# Altium schematic sheet main.SchDoc
size A4; SheetNumber: 1; SheetTotal: 6
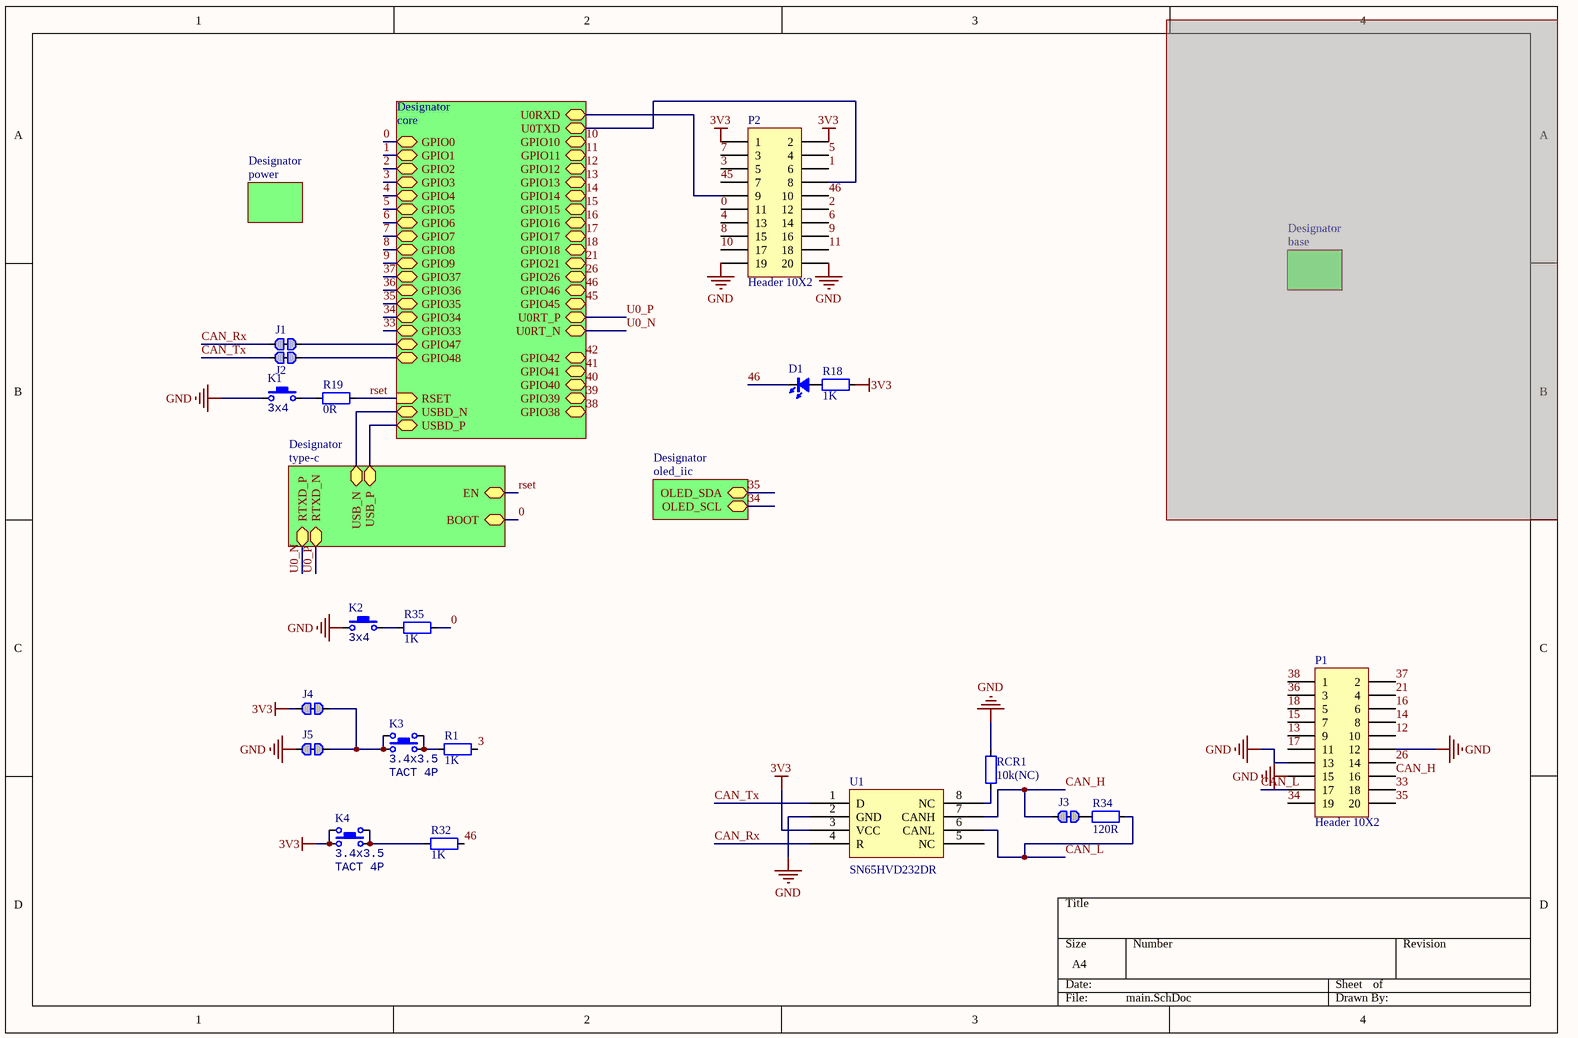
[diagram p0: main.SchDoc]

## Parts
D1  color?  [LED_0402_RED]  (value not drawn)
J1  跳线  [0402-0R]  (value not drawn)
J2  跳线  [0402-0R]  (value not drawn)
J3  跳线  [0402-0R]  (value not drawn)
J4  跳线  [0402-0R]  (value not drawn)
J5  跳线  [0402-0R]  (value not drawn)
K1  value 3x4  [ButtonTACT_3x4x2_180]  (hidden comment: TACT 2P)
K2  value 3x4  [ButtonTACT_3x4x2_180]  (hidden comment: TACT 2P)
K3  value 3.4x3.5  [ButtonTACT_3.5*3.55_90]  (hidden comment: TACT 4P)
K4  value 3.4x3.5  [ButtonTACT_3.5*3.55_90]  (hidden comment: TACT 4P)
P1  Header 10X2  [HEAER_0.8mm_2x10P_M]
P2  Header 10X2  [HEAER_0.8mm_2x10P_M]
R1  1K  [RES_0402]
R18  1K  [RES_0402]
R19  0R  [RES_0402]
R32  1K  [RES_0402]
R34  120R  [RES_0402]
R35  1K  [RES_0402]
RCR1  10k(NC)  [RES_0402]
U1  Manufacturer Part Number: SN65HVD232DR  [SO-8]  (hidden comment: SN65HVD232D)

## Sub-sheets
Designator = core: GPIO1 (bidir), GPIO2 (bidir), GPIO3 (bidir), GPIO4 (bidir), GPIO5 (bidir), GPIO6 (bidir), GPIO7 (bidir), GPIO8 (bidir), GPIO9 (bidir), GPIO37 (bidir), GPIO36 (bidir), GPIO35 (bidir), GPIO34 (bidir), GPIO47 (bidir), GPIO33 (bidir), GPIO48 (bidir), RSET (in), GPIO0 (bidir), GPIO10 (bidir), GPIO11 (bidir), GPIO12 (bidir), GPIO13 (bidir), GPIO14 (bidir), GPIO15 (bidir), GPIO17 (bidir), GPIO16 (bidir), GPIO18 (bidir), GPIO26 (bidir), GPIO21 (bidir), GPIO45 (bidir), U0RT_P (bidir), U0RT_N (bidir), GPIO42 (bidir), GPIO41 (bidir), GPIO40 (bidir), GPIO39 (bidir), GPIO38 (bidir), GPIO46 (bidir), USBD_N (bidir), USBD_P (bidir), U0TXD (bidir), U0RXD (bidir)
Designator = type-c: USB_P (bidir), USB_N (bidir), RTXD_P (bidir), RTXD_N (bidir), EN (bidir), BOOT (bidir)
Designator = power: no entries
Designator = oled_iic: OLED_SDA (bidir), OLED_SCL (bidir)
Designator = base (masked out): no entries

## Nets
3V3: J4.1 K4.1 K4.3 P2.1 P2.2 R18.1 U1.3(VCC)
GND: J5.1 K1.1 K2.1 P1.12 P1.13 P1.15 P2.19 P2.20 RCR1.2 U1.2(GND)
0: P2.11 R35.2 ; sheet Designator/GPIO0, sheet Designator/BOOT
1: P2.6 ; sheet Designator/GPIO1
2: P2.12 ; sheet Designator/GPIO2
3: P2.5 R1.2 ; sheet Designator/GPIO3
4: P2.13 ; sheet Designator/GPIO4
5: P2.4 ; sheet Designator/GPIO5
6: P2.14 ; sheet Designator/GPIO6
7: P2.3 ; sheet Designator/GPIO7
8: P2.15 ; sheet Designator/GPIO8
9: P2.16 ; sheet Designator/GPIO9
10: P2.17 ; sheet Designator/GPIO10
11: P2.18 ; sheet Designator/GPIO11
12: P1.10 ; sheet Designator/GPIO12
13: P1.9 ; sheet Designator/GPIO13
14: P1.8 ; sheet Designator/GPIO14
15: P1.7 ; sheet Designator/GPIO15
16: P1.6 ; sheet Designator/GPIO16
17: P1.11 ; sheet Designator/GPIO17
18: P1.5 ; sheet Designator/GPIO18
21: P1.4 ; sheet Designator/GPIO21
26: P1.14 ; sheet Designator/GPIO26
33: P1.18 ; sheet Designator/GPIO33
34: P1.19 ; sheet Designator/GPIO34, sheet Designator/OLED_SCL
35: P1.20 ; sheet Designator/GPIO35, sheet Designator/OLED_SDA
36: P1.3 ; sheet Designator/GPIO36
37: P1.2 ; sheet Designator/GPIO37
38: P1.1 ; sheet Designator/GPIO38
39: sheet Designator/GPIO39
40: sheet Designator/GPIO40
41: sheet Designator/GPIO41
42: sheet Designator/GPIO42
45: P2.7 ; sheet Designator/GPIO45
46: D1.2(K) P2.10 R32.2 ; sheet Designator/GPIO46
CAN_H: J3.1 P1.16 U1.7(CANH)
CAN_L: P1.17 R34.2 U1.6(CANL)
CAN_Rx: J1.1 U1.4(R)
CAN_Tx: J2.1 U1.1(D)
rset: R19.2 ; sheet Designator/RSET, sheet Designator/EN
U0_N: sheet Designator/U0RT_N, sheet Designator/RTXD_P
U0_P: sheet Designator/U0RT_P, sheet Designator/RTXD_N
NetD1_1: D1.1(A) R18.2
NetJ1_2: J1.2 ; sheet Designator/GPIO47
NetJ2_2: J2.2 ; sheet Designator/GPIO48
NetJ3_2: J3.2 R34.1
NetJ4_2: J4.2 J5.2 K3.1 K3.3
NetK1_2: K1.2 R19.1
NetK2_2: K2.2 R35.1
NetK3_2: K3.2 K3.4 R1.1
NetK4_2: K4.2 K4.4 R32.1
NetP2_8: P2.8 ; sheet Designator/U0TXD
NetP2_9: P2.9 ; sheet Designator/U0RXD
NetRCR1_1: RCR1.1 U1.8(NC)
(unnamed): sheet Designator/USBD_N, sheet Designator/USB_N
(unnamed): sheet Designator/USBD_P, sheet Designator/USB_P

Not connected (* = marked no-connect by the designer): U1 5(NC)

## Library data of the parts
D1 = LED_0402: LED; Type: 0402; Value: color?
J1-J5 = 跳线: Resistor; Published: 8-Jun-2000; LatestRevisionDate: 17-Jul-2002; LatestRevisionNote: Re-released for DXP Platform.; PackageReference: AXIAL-0.4; Publisher: Altium Limited; PackageDescription: Axial Device, Thru-Hole; 2 Leads; 0.4 in Pin Spacing
K1 K2 = ButtonTACT_3x4x2_180: Button; type: TACT 2P
K3 K4 = ButtonTACT: Button; type: TACT 4P
P1 P2 = Header 10X2: Header, 10-Pin, Dual row; LatestRevisionDate: 17-Jul-2002; LatestRevisionNote: Re-released for DXP Platform.; Publisher: Altium Limited
R1 R18 R19 R32 R34 R35 RCR1 = 电阻-0402: Resistor; Value: 22R
U1 = SN65HVD232D: Manufacturer: Texas Instruments; Protocol: CAN; Number of Drivers/Receivers: 1/1; Duplex: Half; Data Rate: 1Mbps; Voltage - Supply: 3 V ~ 3.6 V; Supplier 1: Digi-Key; Supplier Part Number 1: 296-26344-2-ND; RoHS: RoHS Compliant; Category: Integrated Circuits (ICs); Stock: 5000; Pricing 1: 2500=0.84375 (USD); Packaging: Tape & Reel (TR); Part Status: Active; Type: Transceiver; Operating Temperature: -40°C ~ 85°C; Mounting Type: Surface Mount; Package / Case: 8-SOIC (0.154", 3.90mm Width); Supplier Device Package: 8-SOIC; ComponentLink1URL: http://www.ti.com/lit/ds/symlink/sn65hvd230.pdf; ComponentLink1Description: http://www.ti.com/lit/ds/symlink/sn65hvd230.pdf; Supplier 2: Digi-Key; Supplier Part Number 2: 296-26344-1-ND; Pricing 2: 1=2.05, 10=1.842, 100=1.4809, 500=1.21668, 1000=1.00811 (USD)